# EAGLE schematic 1.a.i.12_capacitance_schem (EAGLE 7.1.0)
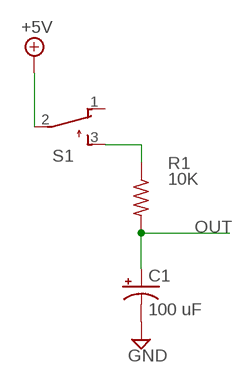
[diagram p0: schematic, sheet 1]

## Parts
C1  100 uF  CPOL-USB45181B  [B45181B]
R1  10K  R-US_0204/7  [0204/7]
S1  TL32PO  [TL3XPO]

## Nets
+5V: S1.2(P)
GND: C1.-
N$2: R1.1 S1.3(S)
OUT: C1.+ R1.2
Unconnected: S1.1(O)

## Library data of the parts
C1 = resistor:CPOL-US: POLARIZED CAPACITOR, American symbol
R1 = resistor:R-US_: RESISTOR, American symbol
S1 = switch:TL32PO: TINY SWITCH ON - MOM Source: http://www2.produktinfo.conrad.com/datenblaetter/700000-724999/705152-da-01-de-Subminiaturschalter_TL_36YO.pdf